# Altium schematic sheet Dual_signal_switch.SchDoc
size A4; Organization: Altium Limited; Address1: L3, 12a Rodborough Rd; Address2: Frenchs Forest; Address3: NSW; Address4: Australia 2086; DocumentNumber: 18; SheetNumber: 18; SheetTotal: 19
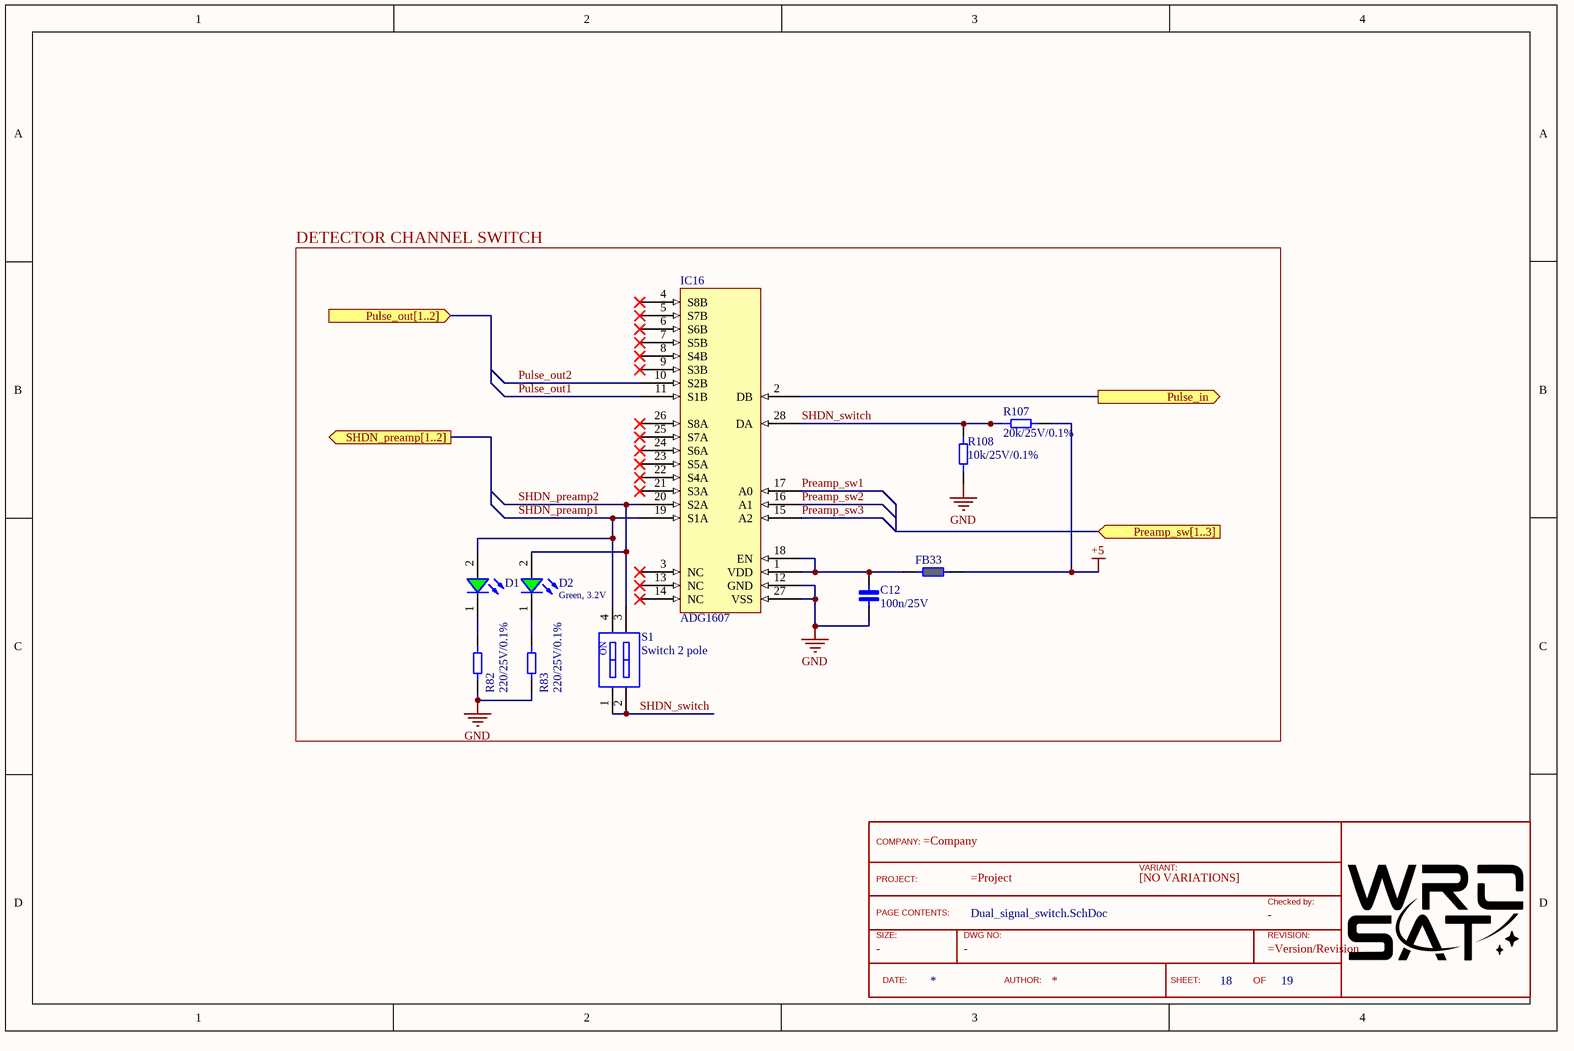
[diagram p0: Dual_signal_switch.SchDoc]

## Parts
?  TitleBlock  (value not drawn)  (graphical)
C12  100n/25V  [Cap_0402]
D1  Green, 3.2V  [WL-SMCW_0603_H=0.7mm]  (value not drawn)
D2  Green, 3.2V  [WL-SMCW_0603_H=0.7mm]
FB33  Ferrite_bead_0402  [FERRITE_0402]  (value not drawn)
IC16  ADG1607  [TSOP28]
R82  220/25V/0.1%  [RES_0402]
R83  220/25V/0.1%  [RES_0402]
R107  20k/25V/0.1%  [RES_0402]
R108  10k/25V/0.1%  [RES_0402]
S1  Switch 2 pole  [Dip Switch 2]

## Blocks framed on the sheet
DETECTOR CHANNEL SWITCH: C12 D1 D2 FB33 IC16 R82 R83 R107 R108 S1

## Ports
Preamp_sw[1..3] (in), Pulse_in (out), Pulse_out[1..2] (in), SHDN_preamp[1..2] (out)

## Nets
+5: FB33.2 R107.2
GND: C12.1 IC16.12(GND) IC16.27(VSS) R82.1 R83.1 R108.1
Preamp_sw1: IC16.17(A0)
Preamp_sw2: IC16.16(A1)
Preamp_sw3: IC16.15(A2)
Pulse_in: IC16.2(DB) ; port Pulse_in
Pulse_out1: IC16.11(S1B)
Pulse_out2: IC16.10(S2B)
SHDN_preamp1: D1.2(A) IC16.19(S1A) S1.4
SHDN_preamp2: D2.2(A) IC16.20(S2A) S1.3
SHDN_switch: IC16.28(DA) R107.1 R108.2 S1.1 S1.2
NetC12_2: C12.2 FB33.1 IC16.1(VDD) IC16.18(EN)
NetD1_1: D1.1(K) R82.2
NetD2_1: D2.1(K) R83.2

Not connected (* = marked no-connect by the designer): IC16 3(NC)* 4(S8B)* 5(S7B)* 6(S6B)* 7(S5B)* 8(S4B)* 9(S3B)* 13(NC)* 14(NC)* 21(S3A)* 22(S4A)* 23(S5A)* 24(S6A)* 25(S7A)* 26(S8A)*

## Notes on the sheet
- Title
- Size:
- Date:
- A3
- Number:
- Time:
- Revision:
- Sheet
- of
- File:
- (in symbol Switch 2 pole) ON
- (in symbol TitleBlock) COMPANY:; VARIANT:; PROJECT:; [NO VARIATIONS]; PAGE CONTENTS:; Checked by:; SIZE:; DWG NO:; REVISION:; DATE:; AUTHOR:; SHEET:; OF

## Library data of the parts
? = TitleBlock: Standard TitleBlock; DrawingNo: -; Size: -; Checked: -
C12 = Cap_0402_100n: Ceramic Capacitor 100n / 0402 / 25V / ±5%, Wurth Elektronik MLCC; ComponentLink1Description: New link; ComponentLink1URL: https://www.we-online.com/catalog/en/WCAP-CSGP-25VDC
D1 D2 = 150060GS75000: WL-SMCW SMT Mono-color Chip LED Waterclear, size 0603, Green, 3.2V, 140deg; Chip Technology: InGaN; Dominant Wavelength typ.: 525nm; Luminous Intensity typ.: 430mcd; Peak Wavelength typ.: 515nm; Viewing Angle: 140deg; ComponentLink1Description: Manufacturer; ComponentLink1URL: http://www.we-online.de; ComponentLink2URL: https://www.we-online.com/catalog/datasheet/150060GS75000.pdf; ComponentLink2Description: Datasheet; Forward Voltage typ.: 3.2V; Emitting Color: Green; Mounting Technology: SMT; Operating Temperature: -40 to +85degC; Published Date: December 2019; Part Number: 150060GS75000; Packaging: Tape and Reel; Size: 0603; Publisher: Wurth Elektronik
FB33 = Ferrite_bead_0402: Ferrite bead, wurth 74269241102
IC16 = ADG1607: 8-ch MUX; ComponentLink1Description: New link; ComponentLink1URL: https://pl.mouser.com/datasheet/2/609/ADG1606_1607-1502923.pdf
R82 R83 = Res_0402_1: Vishay, thin film resistor 1/25V/0.1%
R107 = Res_0402_20k: Vishay, thin film resistor 20k/25V/0.1%
R108 = Res_0402_10k: Vishay, thin film resistor 10k/25V/0.1%
S1 = Switch 2 pole: WS-DISV Small Compact SMD Dip Switch, Flat Actuator with Top Tape, pitch 1.27mm, 2p; Part Number: 416131160802; Operation Force: 500g; Pole Number: 2; Actuator Type: Flat Type; Circuit: SPST-NO; Rated Current Switching: 25mA; Rated Current Non-Switching: 100mA; Rated Voltage Non-Switching: 50VDC; Rated Voltage Switching: 24VDC; ComponentLink1Description: Manufacturer; ComponentLink1URL: http://www.we-online.de; ComponentLink2Description: Datasheet; ComponentLink2URL: https://katalog.we-online.com/em/datasheet/416131160802.pdf; Pitch: 1.27mm; Contact Material: Copper Alloy; Mounting Technology: SMT; Operating Temperature: -40 to +85degC; Contact Plating: Gold; Packaging: Tape and Reel; Publisher: Wurth Elektronik; Published Date: September 2019